# Altium schematic sheet 光耦驱动.SchDoc
size A4
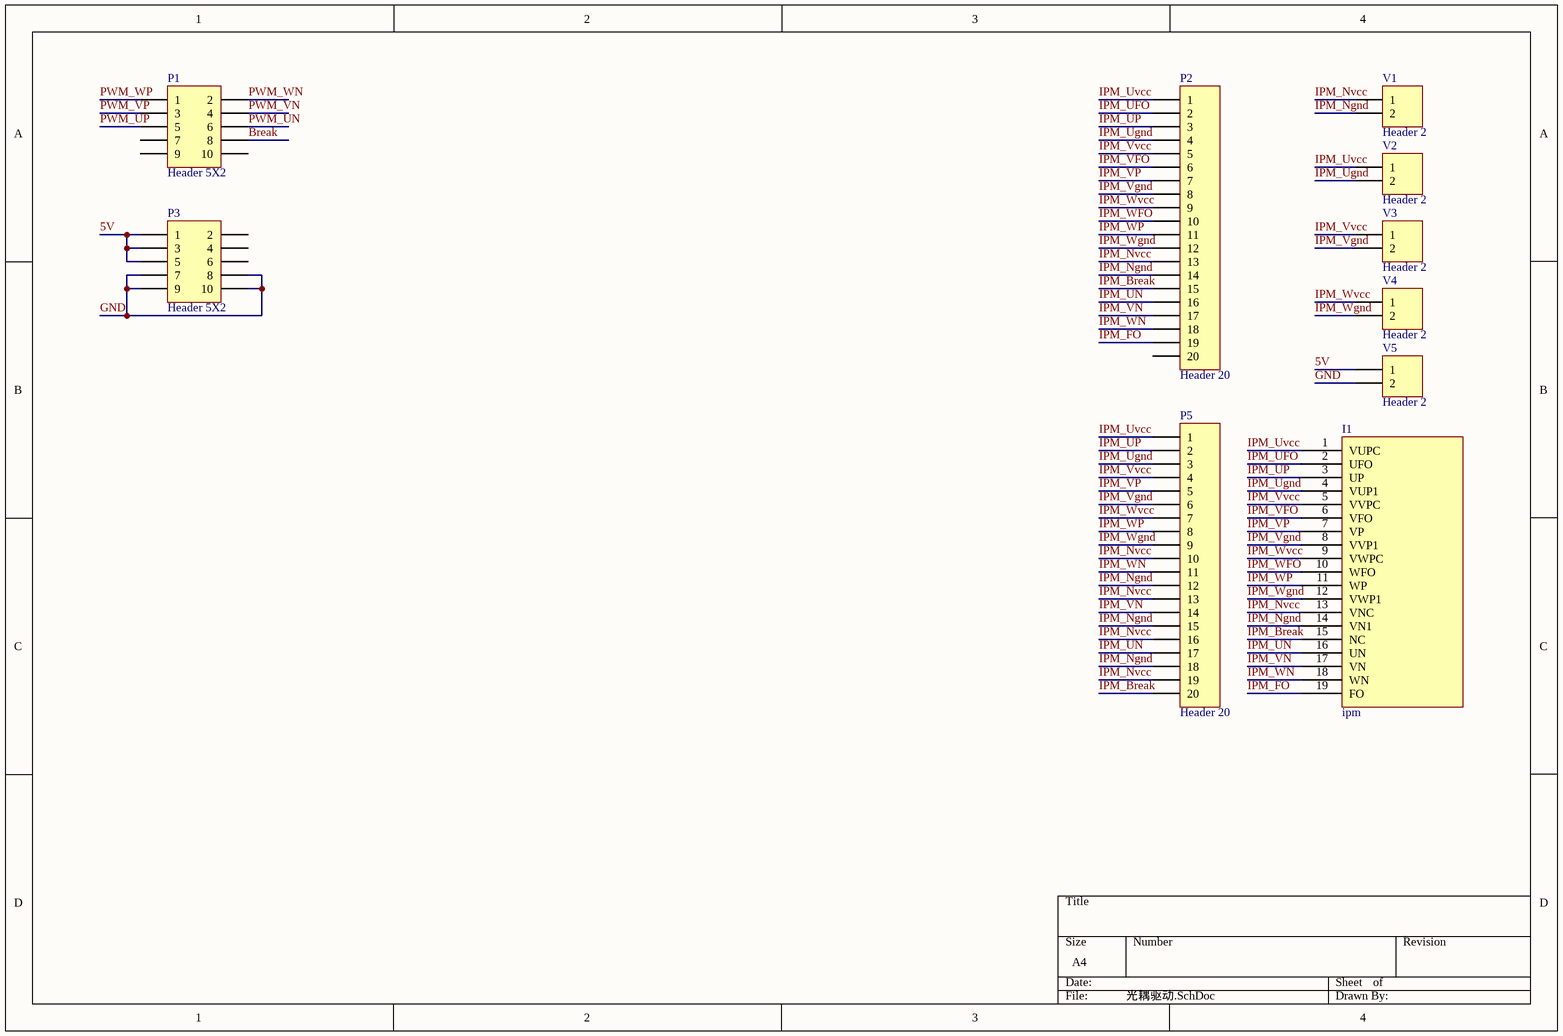
[diagram p0: 光耦驱动.SchDoc]

## Parts
I1  ipm  [ipm]
P1  Header 5X2  [HDR2X5]
P2  Header 20  [HDR1X20]
P3  Header 5X2  [HDR2X5]
P5  Header 20  [HDR1X20]
V1  Header 2  [HDR1X2]
V2  Header 2  [HDR1X2]
V3  Header 2  [HDR1X2]
V4  Header 2  [HDR1X2]
V5  Header 2  [HDR1X2]

## Nets
5V: P3.1 P3.3 P3.5 V5.1
Break: P1.8
GND: P3.7 P3.8 P3.9 P3.10 V5.2
IPM_Break: I1.15(NC) P2.15 P5.20
IPM_FO: I1.19(FO) P2.19
IPM_Ngnd: I1.14(VN1) P2.14 P5.12 P5.15 P5.18 V1.2
IPM_Nvcc: I1.13(VNC) P2.13 P5.10 P5.13 P5.16 P5.19 V1.1
IPM_UFO: I1.2(UFO) P2.2
IPM_Ugnd: I1.4(VUP1) P2.4 P5.3 V2.2
IPM_UN: I1.16(UN) P2.16 P5.17
IPM_UP: I1.3(UP) P2.3 P5.2
IPM_Uvcc: I1.1(VUPC) P2.1 P5.1 V2.1
IPM_VFO: I1.6(VFO) P2.6
IPM_Vgnd: I1.8(VVP1) P2.8 P5.6 V3.2
IPM_VN: I1.17(VN) P2.17 P5.14
IPM_VP: I1.7(VP) P2.7 P5.5
IPM_Vvcc: I1.5(VVPC) P2.5 P5.4 V3.1
IPM_WFO: I1.10(WFO) P2.10
IPM_Wgnd: I1.12(VWP1) P2.12 P5.9 V4.2
IPM_WN: I1.18(WN) P2.18 P5.11
IPM_WP: I1.11(WP) P2.11 P5.8
IPM_Wvcc: I1.9(VWPC) P2.9 P5.7 V4.1
PWM_UN: P1.6
PWM_UP: P1.5
PWM_VN: P1.4
PWM_VP: P1.3
PWM_WN: P1.2
PWM_WP: P1.1

Not connected (* = marked no-connect by the designer): P1 7 9 10; P2 20; P3 2 4 6

## Library data of the parts
P1 P3 = Header 5X2: Header, 5-Pin, Dual row; LatestRevisionDate: 17-Jul-2002; LatestRevisionNote: Re-released for DXP Platform.; Publisher: Altium Limited
P2 P5 = Header 20: Header, 20-Pin; LatestRevisionDate: 17-Jul-2002; LatestRevisionNote: Re-released for DXP Platform.; Publisher: Altium Limited
V1-V5 = Header 2: Header, 2-Pin; LatestRevisionDate: 17-Jul-2002; LatestRevisionNote: Re-released for DXP Platform.; Publisher: Altium Limited